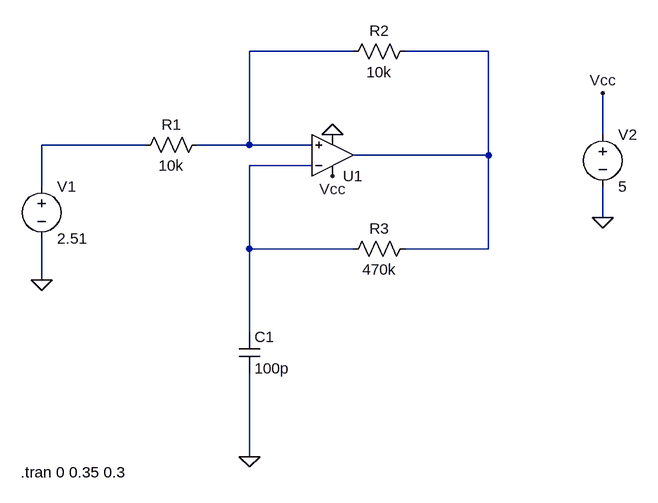
[diagram p0: schematic touch_sensor_oscillator.asc]
touch_sensor_oscillator.asc, the LTspice schematic file:
Version 4.1
SHEET 1 1380 680
WIRE 416 -336 256 -336
WIRE 624 -336 496 -336
WIRE 800 -208 800 -272
WIRE 96 -192 -64 -192
WIRE 256 -192 256 -336
WIRE 256 -192 176 -192
WIRE 352 -192 256 -192
WIRE 624 -176 624 -336
WIRE 624 -176 416 -176
WIRE 352 -160 256 -160
WIRE -64 -128 -64 -192
WIRE 800 -80 800 -128
WIRE 256 -32 256 -160
WIRE 416 -32 256 -32
WIRE 624 -32 624 -176
WIRE 624 -32 496 -32
WIRE -64 16 -64 -48
WIRE 256 96 256 -32
WIRE 256 288 256 160
FLAG -64 16 0
FLAG 256 288 0
FLAG 384 -208 0
FLAG 800 -80 0
FLAG 800 -272 Vcc
FLAG 384 -144 Vcc
SYMBOL cap 240 96 R0
SYMATTR InstName C1
SYMATTR Value 100p
SYMBOL res 192 -208 R90
WINDOW 0 0 56 VBottom 2
WINDOW 3 32 56 VTop 2
SYMATTR InstName R1
SYMATTR Value 10k
SYMBOL res 512 -352 R90
WINDOW 0 0 56 VBottom 2
WINDOW 3 32 56 VTop 2
SYMATTR InstName R2
SYMATTR Value 10k
SYMBOL res 512 -48 R90
WINDOW 0 0 56 VBottom 2
WINDOW 3 32 56 VTop 2
SYMATTR InstName R3
SYMATTR Value 470k
SYMBOL OpAmps\\UniversalOpAmp2 384 -176 M180
SYMATTR InstName U1
SYMBOL voltage -64 -144 R0
WINDOW 123 0 0 Left 0
WINDOW 39 0 0 Left 0
SYMATTR InstName V1
SYMATTR Value 2.51
SYMBOL voltage 800 -224 R0
WINDOW 123 0 0 Left 0
WINDOW 39 0 0 Left 0
SYMATTR InstName V2
SYMATTR Value 5
TEXT -96 312 Left 2 !.tran 0 0.35 0.3

The netlist it stands for:
* touch_sensor_oscillator.asc
C1 N004 0 100p
R1 N001 N003 10k
R2 N002 N001 10k
R3 N002 N004 470k
X§U1 N001 N004 Vcc 0 N002 level2 Avol=1Meg GBW=10Meg Slew=10Meg Ilimit=25m Rail=0 Vos=0 En=0 Enk=0 In=0 Ink=0 Rin=500Meg  ; pins In+ In- V+ V- OUT
V1 N003 0 2.51
V2 Vcc 0 5
.tran 0 0.35 0.3
.lib UniversalOpAmp2.lib
.backanno
.end